# Altium project foxbms2-master.PrjPcb (part 3 of 8)

## Sheet ethernet-phy.SchDoc
size A3; DocumentNumber: 7; SheetNumber: 7; SheetTotal: 45; SheetDescription: Ethernet PHY
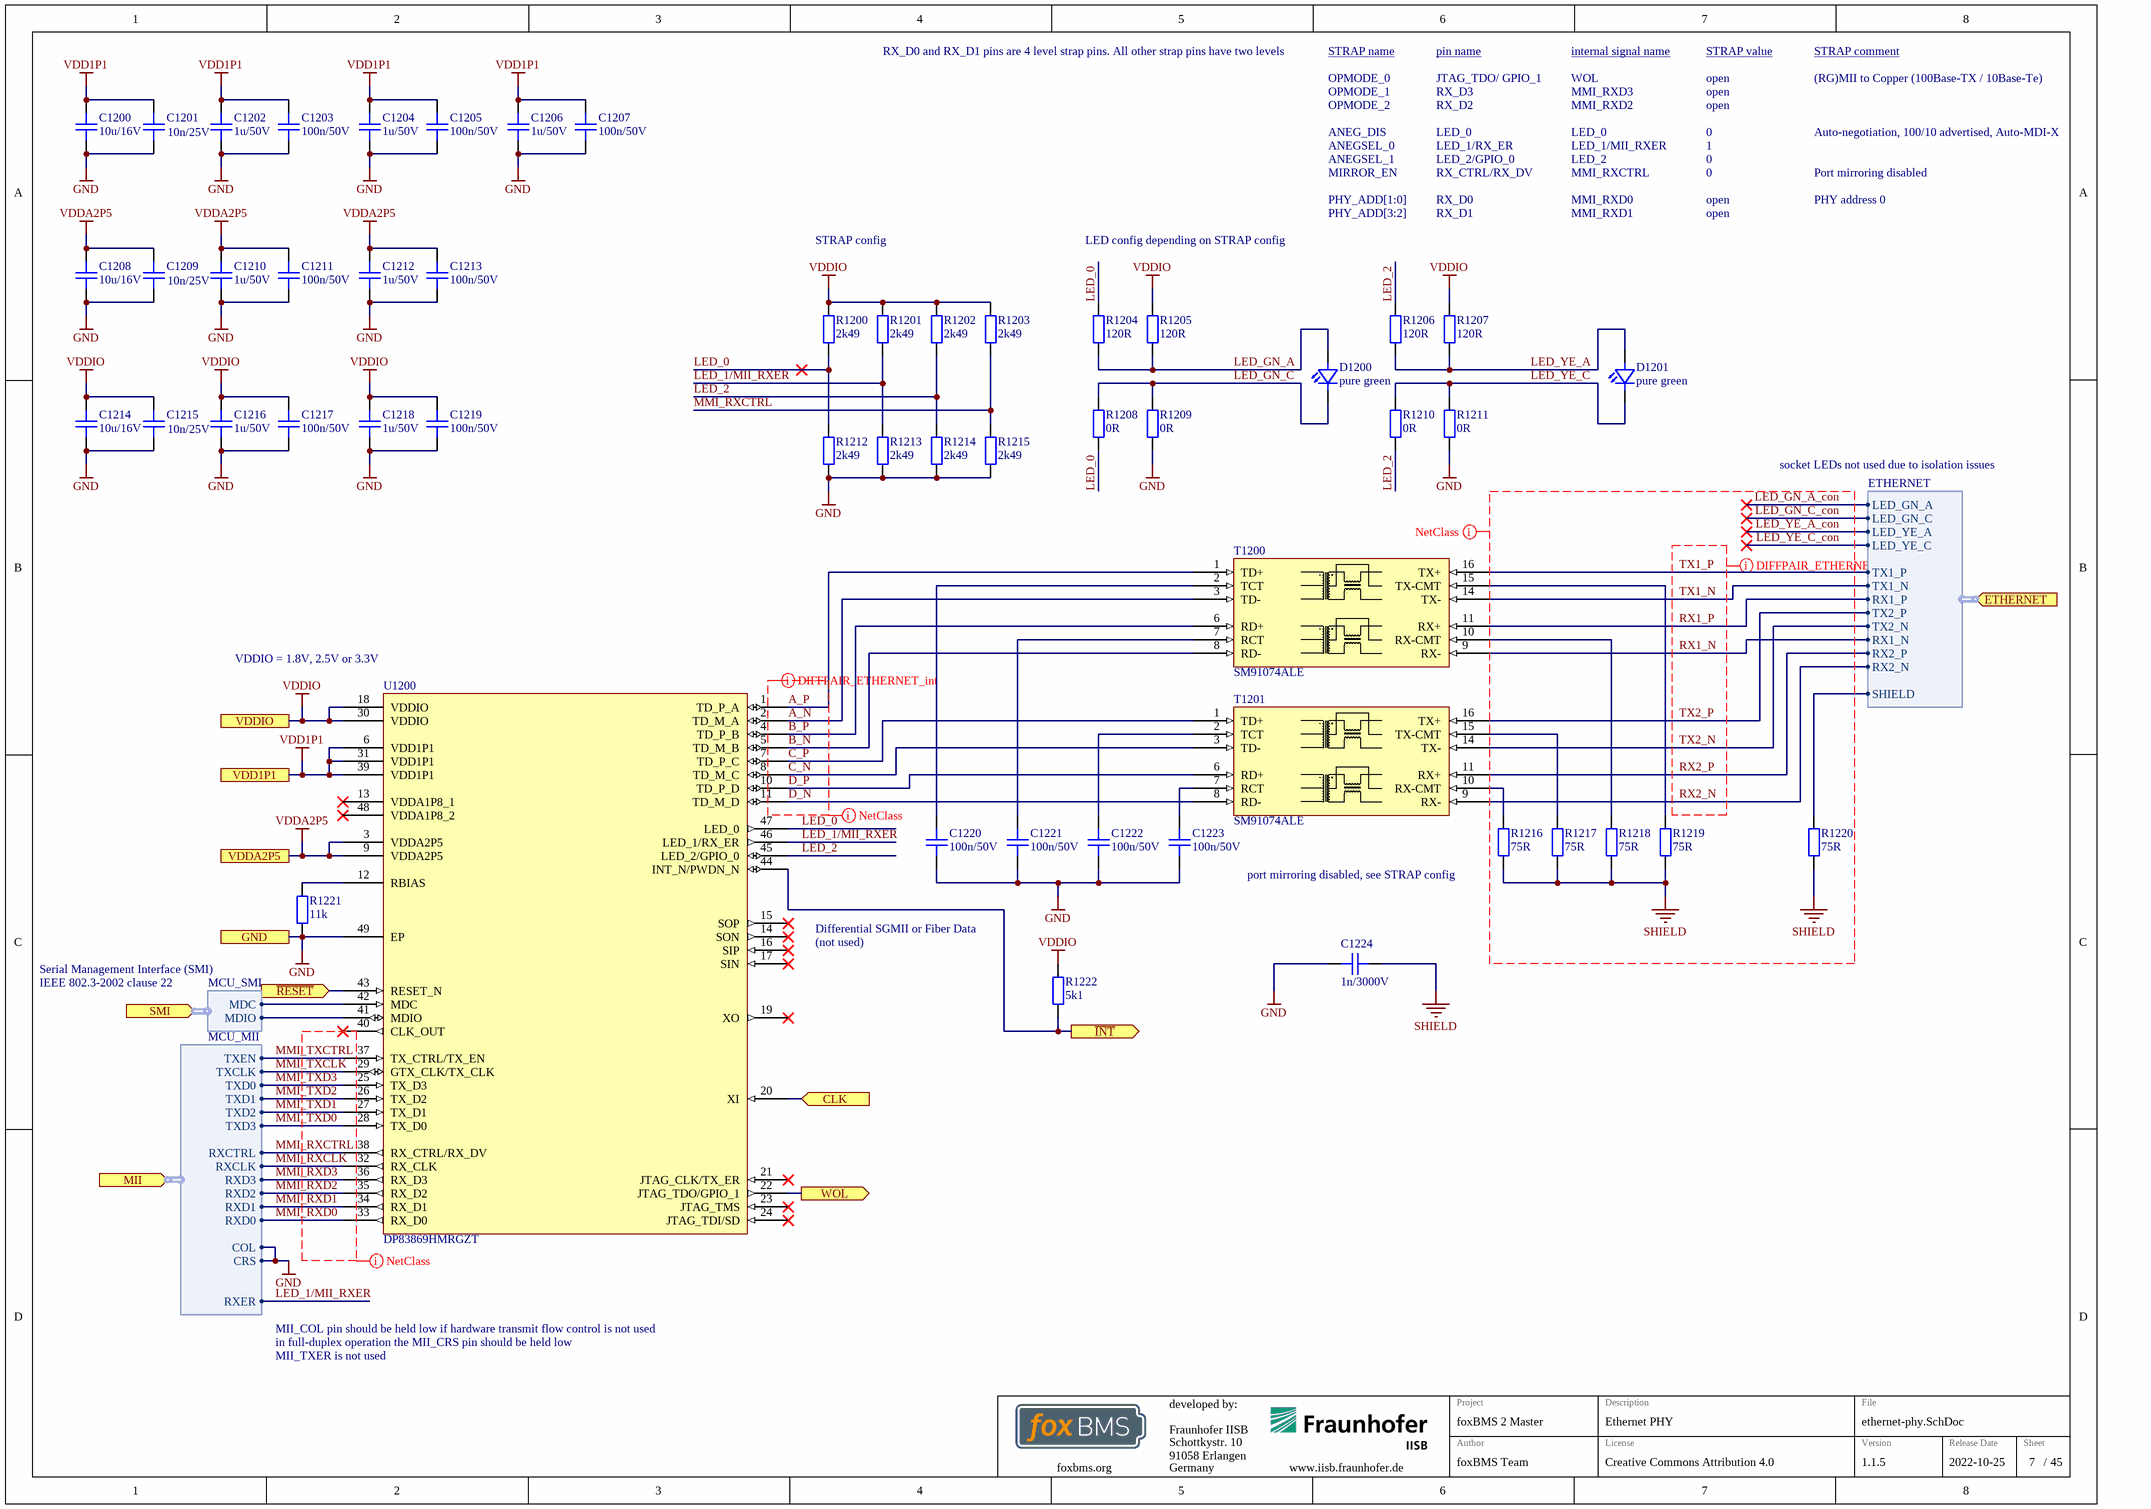
[diagram p14: ethernet-phy.SchDoc]

### Parts
C1200  10u/16V  [CAPC2012X14N]
C1201  10n/25V  [CAPC1005X06N]
C1202  1u/50V  [CAPC1608X08N]
C1203  100n/50V  [CAPC1005X06N]
C1204  1u/50V  [CAPC1608X08N]
C1205  100n/50V  [CAPC1005X06N]
C1206  1u/50V  [CAPC1608X08N]
C1207  100n/50V  [CAPC1005X06N]
C1208  10u/16V  [CAPC2012X14N]
C1209  10n/25V  [CAPC1005X06N]
C1210  1u/50V  [CAPC1608X08N]
C1211  100n/50V  [CAPC1005X06N]
C1212  1u/50V  [CAPC1608X08N]
C1213  100n/50V  [CAPC1005X06N]
C1214  10u/16V  [CAPC2012X14N]
C1215  10n/25V  [CAPC1005X06N]
C1216  1u/50V  [CAPC1608X08N]
C1217  100n/50V  [CAPC1005X06N]
C1218  1u/50V  [CAPC1608X08N]
C1219  100n/50V  [CAPC1005X06N]
C1220  100n/50V  [CAPC1005X06N]
C1221  100n/50V  [CAPC1005X06N]
C1222  100n/50V  [CAPC1005X06N]
C1223  100n/50V  [CAPC1005X06N]
C1224  1n/3000V  [CAPC2220(5750)230_N]
D1200  pure green  [LEDC1608X07N]
D1201  pure green  [LEDC1608X07N]
R1200  2k49  [RESC1005X04N]
R1201  2k49  [RESC1005X04N]
R1202  2k49  [RESC1005X04N]
R1203  2k49  [RESC1005X04N]
R1204  120R  [RESC1005X04N]
R1205  120R  [RESC1005X04N]
R1206  120R  [RESC1005X04N]
R1207  120R  [RESC1005X04N]
R1208  0R  [RESC1005X04N]
R1209  0R  [RESC1005X04N]
R1210  0R  [RESC1005X04N]
R1211  0R  [RESC1005X04N]
R1212  2k49  [RESC1005X04N]
R1213  2k49  [RESC1005X04N]
R1214  2k49  [RESC1005X04N]
R1215  2k49  [RESC1005X04N]
R1216  75R  [RESC1005X04N]
R1217  75R  [RESC1005X04N]
R1218  75R  [RESC1005X04N]
R1219  75R  [RESC1005X04N]
R1220  75R  [RESC1005X04N]
R1221  11k  [RESC1005X04N]
R1222  5k1  [RESC1005X04N]
T1200  SM91074ALE  [SM91074ALE]
T1201  SM91074ALE  [SM91074ALE]
U1200  DP83869HMRGZT  [DP83869HM-RGZ]

### Ports
CLK (in), ETHERNET (in, harness ETHERNET), GND, MII (in, harness MCU_MII), SMI (in, harness MCU_SMI), VDD1P1, VDDA2P5, VDDIO, WOL (out), ~{INT} (out), ~{RESET} (in)

### Harnesses
MCU_MII: TXD0, TXD1, TXD2, TXD3, TXEN, TXCLK, RXCTRL, RXCLK, RXD3, RXD2, RXD0, RXD1, RXER, COL, CRS
MCU_SMI: MDC, MDIO
ETHERNET: TX1_P, TX1_N, RX1_P, TX2_P, TX2_N, RX1_N, RX2_P, RX2_N, SHIELD, LED_YE_C, LED_YE_A, LED_GN_C, LED_GN_A

### Nets
GND: C1200.1 C1201.1 C1202.1 C1203.1 C1204.1 C1205.1 C1206.1 C1207.1 C1208.1 C1209.1 C1210.1 C1211.1 C1212.1 C1213.1 C1214.1 C1215.1 C1216.1 C1217.1 C1218.1 C1219.1 C1220.1 C1221.1 C1222.1 C1223.1 C1224.1 R1209.1 R1211.1 R1212.1 R1213.1 R1214.1 R1215.1 R1221.1 U1200.49(EP) ; port GND, port MII.COL, port MII.CRS
SHIELD: C1224.2 R1216.1 R1217.1 R1218.1 R1219.1 R1220.1
VDD1P1: C1200.2 C1201.2 C1202.2 C1203.2 C1204.2 C1205.2 C1206.2 C1207.2 U1200.6(VDD1P1) U1200.31(VDD1P1) U1200.39(VDD1P1) ; port VDD1P1  [project net MCU_1.1V]
VDDA2P5: C1208.2 C1209.2 C1210.2 C1211.2 C1212.2 C1213.2 U1200.3(VDDA2P5) U1200.9(VDDA2P5) ; port VDDA2P5  [project net MCU_2.5V]
VDDIO: C1214.2 C1215.2 C1216.2 C1217.2 C1218.2 C1219.2 R1200.2 R1201.2 R1202.2 R1203.2 R1205.2 R1207.2 R1222.2 U1200.18(VDDIO) U1200.30(VDDIO) ; port VDDIO  [project net MCU_3.3V]
A_N: T1200.3(TD-) U1200.2(TD_M_A)  [project net A_N_7]
A_P: T1200.1(TD+) U1200.1(TD_P_A)  [project net A_P_7]
B_N: T1200.8(RD-) U1200.5(TD_M_B)  [project net B_N_7]
B_P: T1200.6(RD+) U1200.4(TD_P_B)  [project net B_P_7]
C_N: T1201.3(TD-) U1200.8(TD_M_C)  [project net C_N_7]
C_P: T1201.1(TD+) U1200.7(TD_P_C)  [project net C_P_7]
COM_IO~{.}ETH_INT: R1222.1 U1200.44(INT_N/PWDN_N) ; port ~{INT}
COM_IO_PE.IO1_2: U1200.43(RESET_N) ; port ~{RESET}
D_N: T1201.8(RD-) U1200.11(TD_M_D)  [project net D_N_7]
D_P: T1201.6(RD+) U1200.10(TD_P_D)  [project net D_P_7]
ETHERNET.SHIELD: R1220.2 ; port ETHERNET.SHIELD
LED_0: R1200.1 R1204.2 R1208.1 R1212.2 U1200.47(LED_0)  [project net LED_0_7]
LED_1/MII_RXER: R1201.1 R1213.2 U1200.46(LED_1/RX_ER) ; port MII.RXER  [project net MCU_MII.RXER]
LED_2: R1202.1 R1206.2 R1210.1 R1214.2 U1200.45(LED_2/GPIO_0)  [project net LED_2_7]
LED_GN_A: D1200.2(A) R1204.1 R1205.1  [project net LED_GN_A_7]
LED_GN_C: D1200.1(C) R1208.2 R1209.2  [project net LED_GN_C_7]
LED_YE_A: D1201.2(A) R1206.1 R1207.1  [project net LED_YE_A_7]
LED_YE_C: D1201.1(C) R1210.2 R1211.2  [project net LED_YE_C_7]
MCU_CLK.25MHz: U1200.20(XI) ; port CLK
MCU_SMI.MDC: U1200.42(MDC) ; port SMI.MDC
MCU_SMI.MDIO: U1200.41(MDIO) ; port SMI.MDIO
MMI_RXCLK: U1200.32(RX_CLK) ; port MII.RXCLK  [project net MCU_MII.RXCLK]
MMI_RXCTRL: R1203.1 R1215.2 U1200.38(RX_CTRL/RX_DV) ; port MII.RXCTRL  [project net MCU_MII.RXCTRL]
MMI_RXD0: U1200.33(RX_D0) ; port MII.RXD0  [project net MCU_MII.RXD0]
MMI_RXD1: U1200.34(RX_D1) ; port MII.RXD1  [project net MCU_MII.RXD1]
MMI_RXD2: U1200.35(RX_D2) ; port MII.RXD2  [project net MCU_MII.RXD2]
MMI_RXD3: U1200.36(RX_D3) ; port MII.RXD3  [project net MCU_MII.RXD3]
MMI_TXCLK: U1200.29(GTX_CLK/TX_CLK) ; port MII.TXCLK  [project net MCU_MII.TXCLK]
MMI_TXCTRL: U1200.37(TX_CTRL/TX_EN) ; port MII.TXEN  [project net MCU_MII.TXEN]
MMI_TXD0: U1200.28(TX_D0) ; port MII.TXD3  [project net MCU_MII.TXD3]
MMI_TXD1: U1200.27(TX_D1) ; port MII.TXD2  [project net MCU_MII.TXD2]
MMI_TXD2: U1200.26(TX_D2) ; port MII.TXD1  [project net MCU_MII.TXD1]
MMI_TXD3: U1200.25(TX_D3) ; port MII.TXD0  [project net MCU_MII.TXD0]
RX1_N: T1200.9(RX-) ; port ETHERNET.RX1_N  [project net ETHERNET.RX1_N]
RX1_P: T1200.11(RX+) ; port ETHERNET.RX1_P  [project net ETHERNET.RX1_P]
RX2_N: T1201.9(RX-) ; port ETHERNET.RX2_N  [project net ETHERNET.RX2_N]
RX2_P: T1201.11(RX+) ; port ETHERNET.RX2_P  [project net ETHERNET.RX2_P]
TX1_N: T1200.14(TX-) ; port ETHERNET.TX1_N  [project net ETHERNET.TX1_N]
TX1_P: T1200.16(TX+) ; port ETHERNET.TX1_P  [project net ETHERNET.TX1_P]
TX2_N: T1201.14(TX-) ; port ETHERNET.TX2_N  [project net ETHERNET.TX2_N]
TX2_P: T1201.16(TX+) ; port ETHERNET.TX2_P  [project net ETHERNET.TX2_P]
NetC1220_2: C1220.2 T1200.2(TCT)
NetC1221_2: C1221.2 T1200.7(RCT)
NetC1222_2: C1222.2 T1201.2(TCT)
NetC1223_2: C1223.2 T1201.7(RCT)
NetR1216_2: R1216.2 T1201.10(RX-CMT)
NetR1217_2: R1217.2 T1201.15(TX-CMT)
NetR1218_2: R1218.2 T1200.10(RX-CMT)
NetR1219_2: R1219.2 T1200.15(TX-CMT)
NetR1221_2: R1221.2 U1200.12(RBIAS)
NetU1200_22: U1200.22(JTAG_TDO/GPIO_1) ; port WOL

Not connected (* = marked no-connect by the designer): U1200 13(VDDA1P8_1)* 14(SON)* 15(SOP)* 16(SIP)* 17(SIN)* 19(XO)* 21(JTAG_CLK/TX_ER)* 23(JTAG_TMS)* 24(JTAG_TDI/SD)* 40(CLK_OUT)* 48(VDDA1P8_2)*

### Layout directives
differential pair; rule Differential Pairs Routing [Pref Gap = 12.5mil    Min Gap  = 6mil    Max Gap  = 12.5milPref Width = 6mil    Min Width  = 4mil    Max Width  = 10mil]: A_N, A_P, B_N, B_P, C_N, C_P, D_N, D_P, RX1_N, RX1_P, RX2_N, RX2_P, TX1_N, TX1_P, TX2_N, TX2_P
net class ETHERNET_EXT: LED_GN_A_con, LED_GN_C_con, LED_YE_A_con, LED_YE_C_con, RX1_N, RX1_P, RX2_N, RX2_P, SHIELD, TX1_N, TX1_P, TX2_N, TX2_P
net class MCU_MII: (no net found under the mark)
net class ETHERNET_INT: A_N, A_P, B_N, B_P, C_N, C_P, D_N, D_P

### Notes on the sheet
- RX_D0 and RX_D1 pins are 4 level strap pins. All other strap pins have two levels
- STRAP name
- OPMODE_0
- OPMODE_1
- OPMODE_2
- pin name
- JTAG_TDO/ GPIO_1
- RX_D3
- RX_D2
- internal signal name
- WOL
- MMI_RXD3
- MMI_RXD2
- STRAP value
- open
- STRAP comment
- (RG)MII to Copper (100Base-TX / 10Base-Te)
- ANEG_DIS
- ANEGSEL_0
- ANEGSEL_1
- MIRROR_EN
- LED_0
- LED_1/RX_ER
- LED_2/GPIO_0
- RX_CTRL/RX_DV
- LED_1/MII_RXER
- LED_2
- MMI_RXCTRL
- 0
- 1
- Auto-negotiation, 100/10 advertised, Auto-MDI-X
- Port mirroring disabled
- STRAP config
- LED config depending on STRAP config
- PHY_ADD[1:0]
- PHY_ADD[3:2]
- RX_D0
- RX_D1
- MMI_RXD0
- MMI_RXD1
- PHY address 0
- socket LEDs not used due to isolation issues
- (near U1200) VDDIO = 1.8V, 2.5V or 3.3V
- (near R1216) port mirroring disabled, see STRAP config
- Serial Management Interface (SMI)
- IEEE 802.3-2002 clause 22
- Differential SGMII or Fiber Data
- (not used)
- MII_COL pin should be held low if hardware transmit flow control is not used
- in full-duplex operation the MII_CRS pin should be held low
- MII_TXER is not used
- Fraunhofer IISB
- Schottkystr. 10
- developed by:
- 91058 Erlangen
- Germany
- Author
- Project
- License
- Description
- File
- Version
- Release Date
- Sheet
- foxbms.org <https://foxbms.org>
- www.iisb.fraunhofer.de <https://www.iisb.fraunhofer.de/>
- foxBMS Team
- /

### Library data of the parts
C1200 C1208 C1214 = gen_C_ceramic_10u_16V_X7R_0805: MLCC; Capacitance: 10u; Rated Voltage: 16V; Dielectric: X7S; Case EIA: 0805; Case Metric: 2012; Automotive Qualified: True; AEC-Q Grade: Grade 1; AEC-Q Norm: AEC-Q200; Part Number: gen_C_ceramic_10u_16V_X7R_0805; ECCN: EAR99; Supplier 1: Digikey; Supplier Part Number 1: 445-16110-1-ND
C1201 C1209 C1215 = gen_C_ceramic_10n_25V_X7R_0402: MLCC; Capacitance: 10n; Rated Voltage: 25V; Dielectric: X7R; Case EIA: 0402; Case Metric: 1005; PnP Package: 0402C; PnP Value: 10nF/25V/X7R; PnP equipped: x; Automotive Qualified: True; Part Number: gen_C_ceramic_10n_25V_X7R_0402; Supplier 1: Farnell; Supplier Part Number 1: 2210793
C1202 C1204 C1206 C1210 C1212 C1216 C1218 = gen_C_ceramic_1u_50V_X7R_0603: MLCC; Capacitance: 1u; Rated Voltage: 50V; Dielectric: X7R; Tolerance: ± 10%; Case EIA: 0603; Case Metric: 1608; Automotive Qualified: False; PnP Package: 0603C; Part Number: gen_C_ceramic_1u_50V_X7R_0603; Operating Temperature: -55°C - +125°C; Supplier 1: Farnell; Supplier Part Number 1: 2779055
C1203 C1205 C1207 C1211 C1213 C1217 C1219-C1223 = gen_C_ceramic_100n_50V_X7R_0402: as C3000 on sheet connectors-internal; Part Number: gen_C_ceramic_100n_50V_X7R_0402; Supplier 1: Farnell; Supplier Part Number 1: 2210822; ECCN: EAR99
C1224 = gen_C_ceramic_1n_3000V_X7R_2220: MLCC; Capacitance: 1n; Rated Voltage: 3000V; Dielectric: X7R; Case EIA: 2220; Case Metric: 5750; Automotive Qualified: True; AEC-Q Norm: AEC-Q200; AEC-Q Grade: Grade 0; Part Number: gen_C_ceramic_1n_3000V_X7R_2220; Supplier 1: Digikey; Supplier Part Number 1: 399-16803-1-ND; ECCN: EAR99
D1200 D1201 = LED_0603_pure_green_AECQ: TLMP1100-GS08; Manufacturer: Vishay; Breakdown Voltage: 5V; Continuous Forward Current: 20mA; Forward Voltage @ 20mA: 2.1V; Automotive Qualified: True; Part Number: LED_0603_pure_green_AECQ; Color: pure green; Operating Temperature: -40°C - 100°C; ComponentLink1Description: Datasheet; ComponentLink1URL: http://www.farnell.com/datasheets/2049164.pdf; Supplier 1: Farnell; Supplier Part Number 1: 1328306; Supplier 2: Digikey; Supplier Part Number 2: 751-1176-1-ND; PnP Package: LED_0603
R1200-R1203 R1212-R1215 = gen_R_2k49_0402: SMD Resistor 2k49 0402; Tolerance: 1%; Power: 0.063W; Case EIA: 0402; Case Metric: 1005; Maximum Working Voltage: 50V; PnP Package: 0402R; Automotive Qualified: True; Part Number: gen_R_2k49_0402; Operating Temperature: -55°C - +155°C; Resistance: 2k49; Series: E96; PnP Value: 2k49; Supplier 1: Farnell; Supplier Part Number 1: 2059135
R1204-R1207 = gen_R_120R_0402: SMD Resistor 120R 0402; Tolerance: 1%; Power: 0.063W; Case EIA: 0402; Case Metric: 1005; Maximum Working Voltage: 50V; PnP Package: 0402R; Automotive Qualified: True; AEC-Q Norm: AEC-Q200; Part Number: gen_R_120R_0402; Operating Temperature: -55°C - +155°C; Resistance: 120R; Series: E24; PnP Value: 120R; Supplier 1: Farnell; Supplier Part Number 1: 2302535; ECCN: EAR99
R1208-R1211 = gen_R_0R_0402: as R1101 on sheet can; Part Number: gen_R_0R_0402; Operating Temperature: -55°C - +155°C; Resistance: 0R; Series: Jumper; PnP Value: 0R; Supplier 1: Farnell; Supplier Part Number 1: 1469661; Supplier 2: Farnell; Supplier Part Number 2: 2059190; ECCN: EAR99
R1216-R1220 = gen_R_75R_0402: SMD Resistor 75R 0402; Tolerance: 1%; Power: 0.063W; Case EIA: 0402; Case Metric: 1005; Maximum Working Voltage: 50V; PnP Package: 0402R; Automotive Qualified: True; AEC-Q Norm: AEC-Q200; AEC-Q Grade: Grade 0; Part Number: gen_R_75R_0402; Operating Temperature: -55°C - +155°C; Resistance: 75R; Series: E24, E96; PnP Value: 75R; ECCN: EAR99; Supplier 1: Farnell; Supplier Part Number 1: 2059111
R1221 = gen_R_11k_0402: SMD Resistor 11k 0402; Tolerance: 1%; Power: 0.063W; Case EIA: 0402; Case Metric: 1005; Maximum Working Voltage: 50V; PnP Package: 0402R; Automotive Qualified: True; AEC-Q Norm: AEC-Q200; Part Number: gen_R_11k_0402; Operating Temperature: -55°C - +155°C; Resistance: 11k; Series: E24, E96; PnP Value: 11k; ECCN: EAR99; Supplier 1: Farnell; Supplier Part Number 1: 2324762
R1222 = gen_R_5k1_0402: SMD Resistor 5k1 0402; Tolerance: 1%; Power: 0.063W; Case EIA: 0402; Case Metric: 1005; Maximum Working Voltage: 50V; PnP Package: 0402R; Automotive Qualified: True; PnP equipped: x; AEC-Q Norm: AEC-Q200; AEC-Q Grade: Grade 0; Part Number: gen_R_5k1_0402; Operating Temperature: -55°C - +155°C; Resistance: 5k1; Series: E24; PnP Value: 5k1; Supplier 1: Farnell; Supplier Part Number 1: 2302709; ECCN: EAR99
T1200 T1201 = SM91074ALE: 10/100 Base-T Transformer; Manufacturer: Bourns; Automotive Qualified: True; Part Number: SM91074ALE; Part Name: SM91074ALE; Operating Temperature: −40°C - +125°C; ComponentLink1Description: Datasheet; ComponentLink1URL: https://datasheet.octopart.com/SM91074ALE-Bourns-datasheet-134093235.pdf; Supplier 1: Farnell; Supplier Part Number 1: 2932105; Supplier 2: Mouser; Supplier Part Number 2: 652-SM91074ALE; Supplier 3: Digikey; Supplier Part Number 3: SM91074ALECT-ND
U1200 = DP83869HMRGZT: High Immunity 10/100/1000 Ethernet Physical Layer Transceiver and Fiber Interface; Manufacturer: Texas Instruments; PnP Package: VQFN-48; Automotive Qualified: False; Part Number: DP83869HMRGZT; Part Name: DP83869HMRGZT; Operating Temperature: −40°C - +125°C; ComponentLink1Description: Datasheet; ComponentLink1URL: http://www.ti.com/lit/ds/symlink/dp83869hm.pdf; Supplier 1: Digikey; Supplier Part Number 1: 296-53377-1-ND; Supplier 2: Mouser; Supplier Part Number 2: 595-DP83869HMRGZT

## Sheet uart.SchDoc
size A3; DocumentNumber: 8; SheetNumber: 8; SheetTotal: 45; SheetDescription: UART Communication
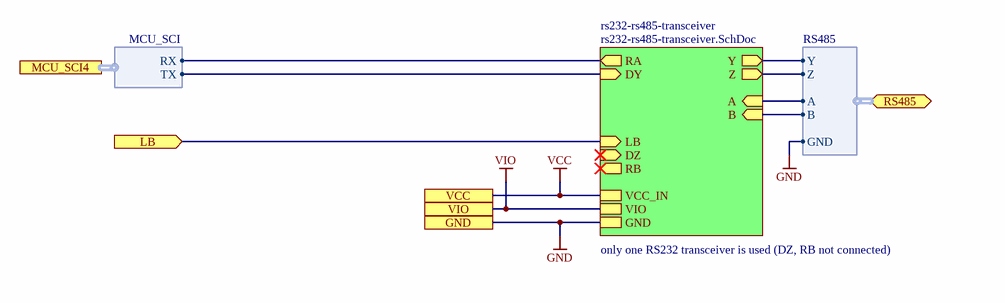
[diagram p15: uart.SchDoc]

### Sub-sheets
rs232-rs485-transceiver = rs232-rs485-transceiver.SchDoc: GND, Z (out), Y (out), B (in), RA (out), DZ (in), A (in), RB (out), DY (in), LB (in), VCC_IN, VIO

### Ports
GND, LB (in), MCU_SCI4 (harness MCU_SCI), RS485 (bidir, harness RS485), VCC, VIO

### Harnesses
RS485: Y, Z, A, B, GND
MCU_SCI: RX, TX

### Nets
GND: port GND, sheet rs232-rs485-transceiver/GND, port RS485.GND
VCC: port VCC, sheet rs232-rs485-transceiver/VCC_IN  [project net PER_5.0V]
VIO: port VIO, sheet rs232-rs485-transceiver/VIO  [project net PER_3.3V]
COM_IO_PE.IO1_4: port LB, sheet rs232-rs485-transceiver/LB
MCU_SCI4.RX: sheet rs232-rs485-transceiver/RA, port MCU_SCI4.RX
MCU_SCI4.TX: sheet rs232-rs485-transceiver/DY, port MCU_SCI4.TX
RS485.A: sheet rs232-rs485-transceiver/A, port RS485.A
RS485.B: sheet rs232-rs485-transceiver/B, port RS485.B
RS485.Y: sheet rs232-rs485-transceiver/Y, port RS485.Y
RS485.Z: sheet rs232-rs485-transceiver/Z, port RS485.Z

### Notes on the sheet
- only one RS232 transceiver is used (DZ, RB not connected)
- Fraunhofer IISB
- Schottkystr. 10
- developed by:
- 91058 Erlangen
- Germany
- Author
- Project
- License
- Description
- File
- Version
- Release Date
- Sheet
- foxbms.org <https://foxbms.org>
- www.iisb.fraunhofer.de <https://www.iisb.fraunhofer.de/>
- foxBMS Team
- /

## Sheet rs232-rs485-transceiver.SchDoc
size A3; DocumentNumber: 9; SheetNumber: 9; SheetTotal: 45; SheetDescription: RS422/RS485 Transceiver
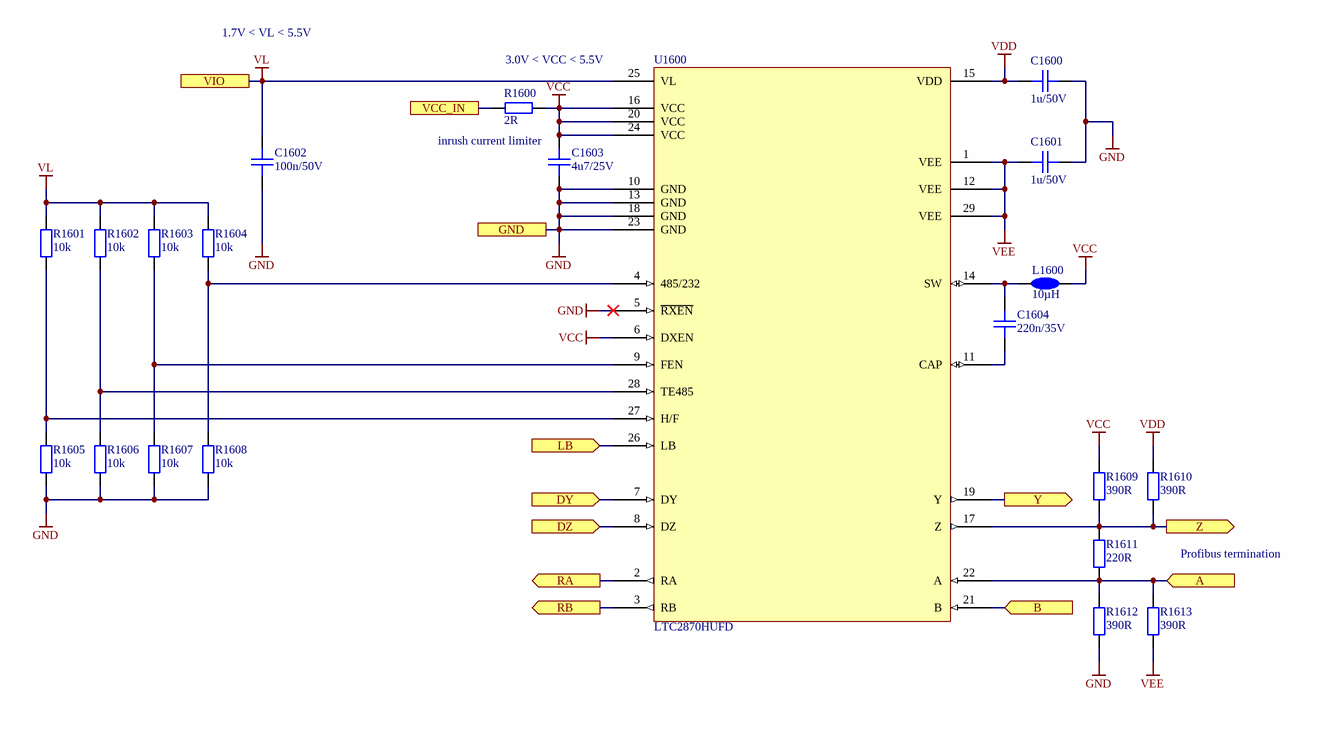
[diagram p16: rs232-rs485-transceiver.SchDoc]

### Parts
C1600  1u/50V  [CAPC1608X08N]
C1601  1u/50V  [CAPC1608X08N]
C1602  100n/50V  [CAPC1005X06N]
C1603  4u7/25V  [CAPC2012X14N]
C1604  220n/35V  [CAPC1005X06N]
L1600  10µH  [INDC2012X14N]
R1600  2R  [RESC2012X05N]
R1601  10k  [RESC1005X04N]
R1602  10k  [RESC1005X04N]
R1603  10k  [RESC1005X04N]
R1604  10k  [RESC1005X04N]
R1605  10k  [RESC1005X04N]
R1606  10k  [RESC1005X04N]
R1607  10k  [RESC1005X04N]
R1608  10k  [RESC1005X04N]
R1609  390R  [RESC1005X04N]
R1610  390R  [RESC1005X04N]
R1611  220R  [RESC1005X04N]
R1612  390R  [RESC1005X04N]
R1613  390R  [RESC1005X04N]
U1600  LTC2870HUFD  [LTC2870-UFD]

### Ports
A (in), B (in), DY (in), DZ (in), GND, LB (in), RA (out), RB (out), VCC_IN, VIO, Y (out), Z (out)

### Nets
GND: C1600.2 C1601.2 C1602.1 C1603.1 R1605.1 R1606.1 R1607.1 R1608.1 R1612.1 U1600.5(~{RXEN}) U1600.10(GND) U1600.13(GND) U1600.18(GND) U1600.23(GND) ; port GND
PER_5.0V: R1600.1 ; port VCC_IN
VCC: C1603.2 L1600.2 R1600.2 R1609.2 U1600.6(DXEN) U1600.16(VCC) U1600.20(VCC) U1600.24(VCC)
VDD: C1600.1 R1610.2 U1600.15(VDD)
VEE: C1601.1 R1613.1 U1600.1(VEE) U1600.12(VEE) U1600.29(VEE)
VL: C1602.2 R1601.2 R1602.2 R1603.2 R1604.2 U1600.25(VL) ; port VIO  [project net PER_3.3V]
COM_IO_PE.IO1_4: U1600.26(LB) ; port LB
MCU_SCI4.RX: U1600.2(RA) ; port RA
MCU_SCI4.TX: U1600.7(DY) ; port DY
RS485.A: R1611.1 R1612.2 R1613.2 U1600.22(A) ; port A
RS485.B: U1600.21(B) ; port B
RS485.Y: U1600.19(Y) ; port Y
RS485.Z: R1609.1 R1610.1 R1611.2 U1600.17(Z) ; port Z
NetC1604_1: C1604.1 U1600.11(CAP)
NetC1604_2: C1604.2 L1600.1 U1600.14(SW)
NetR1601_1: R1601.1 R1605.2 U1600.27(H/F)
NetR1602_1: R1602.1 R1606.2 U1600.28(TE485)
NetR1603_1: R1603.1 R1607.2 U1600.9(FEN)
NetR1604_1: R1604.1 R1608.2 U1600.4(485/232)
NetU1600_3: U1600.3(RB) ; port RB
NetU1600_8: U1600.8(DZ) ; port DZ

### Notes on the sheet
- 1.7V < VL < 5.5V
- 3.0V < VCC < 5.5V
- (near C1603) inrush current limiter
- Profibus termination
- Fraunhofer IISB
- Schottkystr. 10
- developed by:
- 91058 Erlangen
- Germany
- Author
- Project
- License
- Description
- File
- Version
- Release Date
- Sheet
- foxbms.org <https://foxbms.org>
- www.iisb.fraunhofer.de <https://www.iisb.fraunhofer.de/>
- foxBMS Team
- /

### Library data of the parts
C1600 C1601 = gen_C_ceramic_1u_50V_X7R_0603: as C1202 on sheet ethernet-phy; Part Number: gen_C_ceramic_1u_50V_X7R_0603; Operating Temperature: -55°C - +125°C; Supplier 1: Farnell; Supplier Part Number 1: 2779055
C1602 = gen_C_ceramic_100n_50V_X7R_0402: as C3000 on sheet connectors-internal; Part Number: gen_C_ceramic_100n_50V_X7R_0402; Supplier 1: Farnell; Supplier Part Number 1: 2210822; ECCN: EAR99
C1603 = gen_C_ceramic_4u7_25V_X7R_0805: MLCC; Capacitance: 4u7; Rated Voltage: 25V; Dielectric: X7R; Case EIA: 0805; Case Metric: 2012; AVT Set: x; Automotive Qualified: True; AEC-Q Norm: AEC-Q200; Part Number: gen_C_ceramic_4u7_25V_X7R_0805; Supplier 1: Farnell; Supplier Part Number 1: 2346968; ECCN: EAR99
C1604 = gen_C_ceramic_220n_35V_X7R_0402: MLCC; Capacitance: 220n; Rated Voltage: 35V; Dielectric: X7R; Case EIA: 0402; Case Metric: 1005; Automotive Qualified: True; AEC-Q Grade: Grade 1; AEC-Q Norm: AEC-Q200; PnP Package: 0402C; Part Number: gen_C_ceramic_220n_35V_X7R_0402; ECCN: EAR99; Supplier 1: Digikey; Supplier Part Number 1: 445-173767-1-ND
L1600 = LQM21DH100M70L: Power Inductor; Manufacturer: Murata; Rated Current: 300mA; Saturation Current: 250mA; Automotive Qualified: True; Part Number: LQM21DH100M70L; Operating Temperature: -55°C - +150°C; ComponentLink1Description: Datasheet; ComponentLink1URL: https://psearch.en.murata.com/inductor/product/LQM21DH100M70_.pdf; Inductance: 10µH; Supplier 1: Digikey; Supplier Part Number 1: 490-18463-1-ND; Supplier 2: Mouser; Supplier Part Number 2: 81-LQM21DH100M70L
R1600 = gen_R_2R_0805: SMD Resistor 2R 0805; Tolerance: 1%; Power: 0.125W; Case EIA: 0805; Case Metric: 2012; Maximum Working Voltage: 150V; PnP Package: 0805R; Automotive Qualified: True; AEC-Q Grade: Grade 0; AEC-Q Norm: AEC-Q200; Part Number: gen_R_2R_0805; Operating Temperature: -55°C - +155°C; Resistance: 2R; Series: E24, E96; PnP Value: 2R; ECCN: EAR99; Supplier 1: Digikey; Supplier Part Number 1: P19275CT-ND
R1601-R1608 = gen_R_10k_0402: as R1103 on sheet can-transceiver; Part Number: gen_R_10k_0402; Operating Temperature: -55°C - +155°C; Resistance: 10k; Series: E24, E96; PnP Value: 10k; Supplier 1: Farnell; Supplier Part Number 1: 2059239; ECCN: EAR99
R1609 R1610 R1612 R1613 = gen_R_390R_0402: SMD Resistor 390R 0402; Tolerance: 1%; Power: 0.063W; Case EIA: 0402; Case Metric: 1005; Maximum Working Voltage: 50V; PnP Package: 0402R; Automotive Qualified: True; AEC-Q Grade: Grade 0; AEC-Q Norm: AEC-Q200; Part Number: gen_R_390R_0402; Operating Temperature: -55°C - +155°C; Resistance: 390R; Series: E24; PnP Value: 390R; ECCN: EAR99; Supplier 1: Farnell; Supplier Part Number 1: 2563565
R1611 = gen_R_220R_0402: SMD Resistor 220R 0402; Tolerance: 1%; Power: 0.063W; Case EIA: 0402; Case Metric: 1005; Maximum Working Voltage: 50V; PnP Package: 0402R; Automotive Qualified: True; AEC-Q Grade: Grade 0; AEC-Q Norm: AEC-Q200; Part Number: gen_R_220R_0402; Operating Temperature: -55°C - +155°C; Resistance: 220R; Series: E24; PnP Value: 220R; ECCN: EAR99; Supplier 1: Digikey; Supplier Part Number 1: A129619CT-ND
U1600 = LTC2870HUFD: RS-232-IC-Interface RS232/RS485 Multiprotocol Transceiver with Integrated Termination; Manufacturer: Analog Devices; PnP Package: QFN-28; Automotive Qualified: False; Part Number: LTC2870HUFD; Part Name: LTC2870HUFD; Operating Temperature: −40°C - +125°C; ComponentLink1Description: Datasheet; ComponentLink1URL: https://www.analog.com/media/en/technical-documentation/data-sheets/28701fb.pdf; Supplier 1: Mouser; Supplier Part Number 1: 584-LTC2870HUFD#PBF; Supplier 2: Digikey; Supplier Part Number 2: LTC2870HUFD#TRPBF-ND

## Sheet peripherals.SchDoc
size A3; DocumentNumber: 28; SheetNumber: 28; SheetTotal: 45; SheetDescription: MCU Peripherals
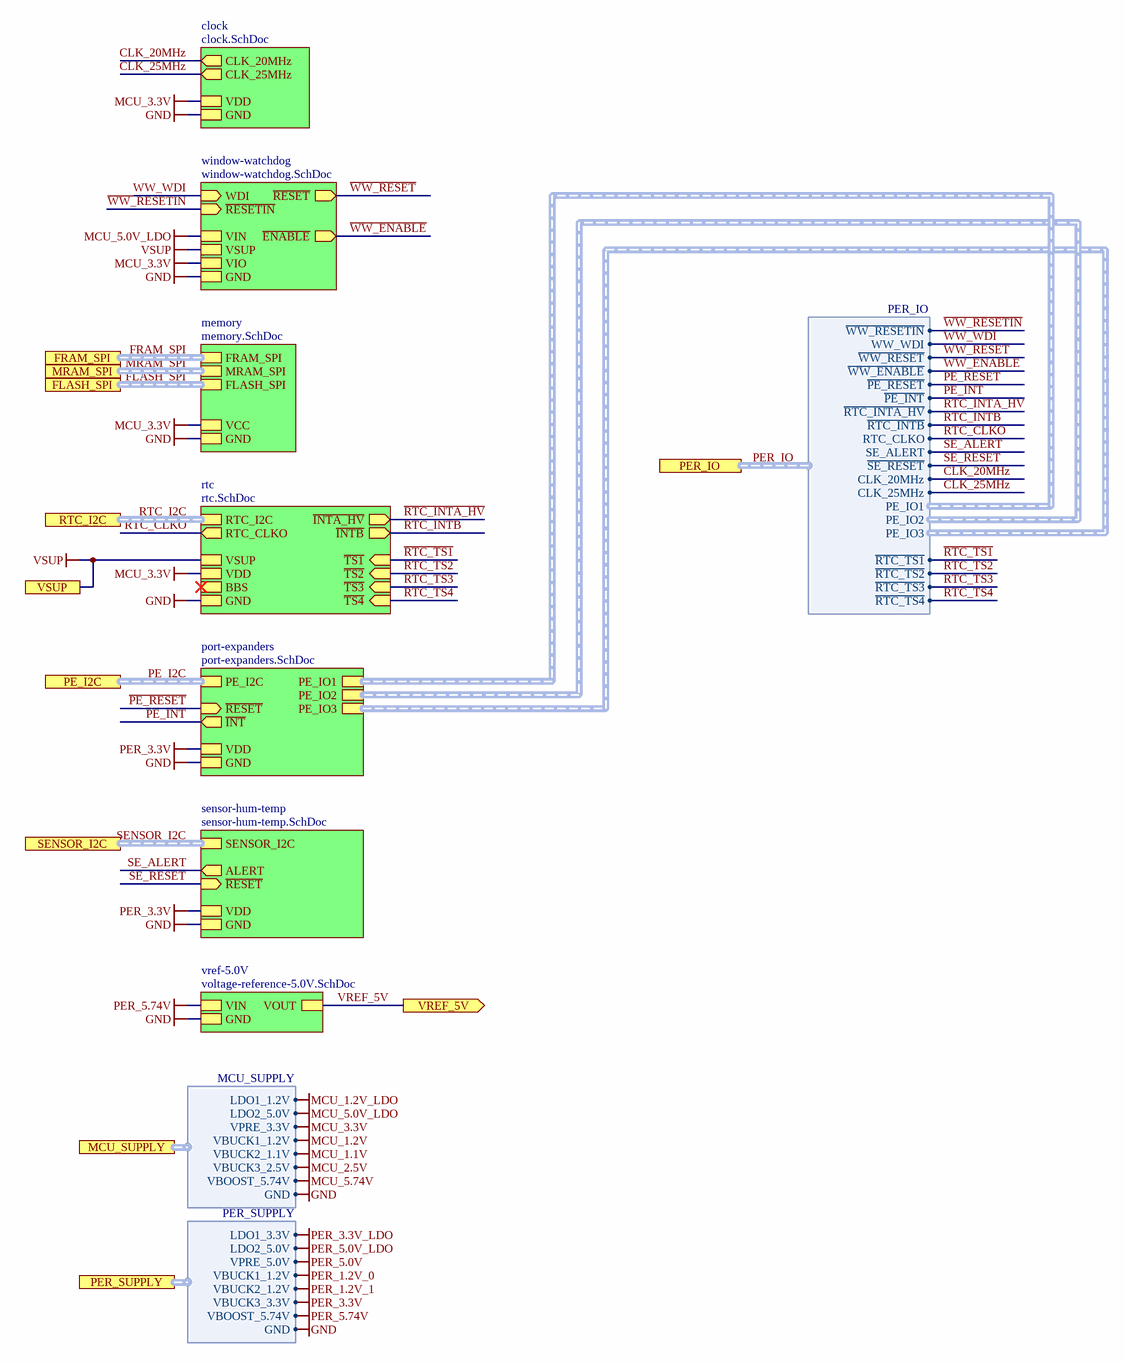
[diagram p17: peripherals.SchDoc]

### Sub-sheets
clock = clock.SchDoc: VDD, GND, CLK_20MHz (out), CLK_25MHz (out)
memory = memory.SchDoc: VCC, GND, FRAM_SPI (harness SPI), MRAM_SPI (harness SPI), FLASH_SPI (harness SPI)
port-expanders = port-expanders.SchDoc: PE_IO2 (harness PE_IO), PE_IO1 (harness PE_IO), GND, VDD, ~{RESET} (in), PE_I2C (harness I2C), ~{INT} (out), PE_IO3 (harness PE_IO)
rtc = rtc.SchDoc: RTC_I2C (harness I2C), ~{INTB} (out), ~{INTA_HV} (out), GND, VSUP, ~{TS4} (in), ~{TS3} (in), ~{TS2} (in), ~{TS1} (in), BBS, RTC_CLKO (out), VDD
sensor-hum-temp = sensor-hum-temp.SchDoc: GND, ~{RESET} (in), ALERT (out), VDD, SENSOR_I2C (harness I2C)
vref-5.0V = voltage-reference-5.0V.SchDoc: GND, VOUT, VIN
window-watchdog = window-watchdog.SchDoc: GND, VIO, ~{ENABLE} (out), ~{RESET} (out), WDI (in), VIN, ~{RESETIN} (in), VSUP

### Ports
FLASH_SPI (harness SPI), FRAM_SPI (harness SPI), MCU_SUPPLY (harness MCU_SUPPLY), MRAM_SPI (harness SPI), PE_I2C (harness I2C), PER_IO (harness PER_IO), PER_SUPPLY (harness PER_SUPPLY), RTC_I2C (harness I2C), SENSOR_I2C (harness I2C), VREF_5V (out), VSUP

### Harnesses
MCU_SUPPLY: VBUCK1_1.2V, VBUCK2_1.1V, VBUCK3_2.5V, LDO1_1.2V, LDO2_5.0V, GND, VPRE_3.3V, VBOOST_5.74V
PER_SUPPLY: GND, VBOOST_5.74V, LDO1_3.3V, LDO2_5.0V, VPRE_5.0V, VBUCK1_1.2V, VBUCK2_1.2V, VBUCK3_3.3V
PER_IO: WW_WDI, ~{WW_RESET}, ~{WW_ENABLE}, ~{PE_RESET}, ~{PE_INT}, ~{RTC_INTA_HV}, ~{RTC_INTB}, RTC_CLKO, SE_ALERT, ~{SE_RESET}, CLK_20MHz, CLK_25MHz, PE_IO1, PE_IO2, PE_IO3, ~{RTC_TS1}, ~{RTC_TS2}, ~{RTC_TS3}, ~{RTC_TS4}, ~{WW_RESETIN}

### Nets
GND: sheet clock/GND, sheet window-watchdog/GND, sheet memory/GND, sheet sensor-hum-temp/GND, sheet rtc/GND, sheet port-expanders/GND, sheet vref-5.0V/GND, port MCU_SUPPLY.GND, port PER_SUPPLY.GND
MCU_3.3V: sheet clock/VDD, sheet window-watchdog/VIO, sheet memory/VCC, sheet rtc/VDD, port MCU_SUPPLY.VPRE_3.3V
MCU_5.0V_LDO: sheet window-watchdog/VIN, port MCU_SUPPLY.LDO2_5.0V
PER_3.3V: sheet sensor-hum-temp/VDD, sheet port-expanders/VDD, port PER_SUPPLY.VBUCK3_3.3V
PER_5.74V: sheet vref-5.0V/VIN, port PER_SUPPLY.VBOOST_5.74V
VREF_5V: port VREF_5V, sheet vref-5.0V/VOUT
VSUP: port VSUP, sheet window-watchdog/VSUP, sheet rtc/VSUP  [project net VSUP_30]
~{PE_INT}: sheet port-expanders/~{INT}, port PER_IO.~{PE_INT}  [project net MCU_GIOB.4]
~{PE_RESET}: sheet port-expanders/~{RESET}, port PER_IO.~{PE_RESET}  [project net MCU_GIOX.M4]
~{RTC_INTA_HV}: sheet rtc/~{INTA_HV}, port PER_IO.~{RTC_INTA_HV}  [project net PER_IO~{.}RTC_INTA_HV]
~{RTC_INTB}: sheet rtc/~{INTB}, port PER_IO.~{RTC_INTB}  [project net MCU_GIOB.1]
~{RTC_TS1}: sheet rtc/~{TS1}, port PER_IO.~{RTC_TS1}  [project net MCU_GIOX.D13]
~{RTC_TS2}: sheet rtc/~{TS2}, port PER_IO.~{RTC_TS2}  [project net MCU_GIOX.D12]
~{RTC_TS3}: sheet rtc/~{TS3}, port PER_IO.~{RTC_TS3}  [project net MCU_GIOX.D11]
~{RTC_TS4}: sheet rtc/~{TS4}, port PER_IO.~{RTC_TS4}  [project net MCU_GIOX.K16]
~{SE_RESET}: sheet sensor-hum-temp/~{RESET}, port PER_IO.~{SE_RESET}  [project net PE_IO3.IO0_0]
~{WW_ENABLE}: sheet window-watchdog/~{ENABLE}, port PER_IO.~{WW_ENABLE}  [project net EXT_CON~{.}WW_ENABLE]
~{WW_RESET}: sheet window-watchdog/~{RESET}, port PER_IO.~{WW_RESET}  [project net ~{DBG_RESET}]
~{WW_RESETIN}: sheet window-watchdog/~{RESETIN}, port PER_IO.~{WW_RESETIN}  [project net EXT_CON~{.}SBC_MCU_RESET]
CLK_20MHz: sheet clock/CLK_20MHz, port PER_IO.CLK_20MHz  [project net EXT_CON.ADC_CLK]
CLK_25MHz: sheet clock/CLK_25MHz, port PER_IO.CLK_25MHz  [project net MCU_CLK.25MHz]
RTC_CLKO: sheet rtc/RTC_CLKO, port PER_IO.RTC_CLKO  [project net MCU_DCC.2]
SE_ALERT: sheet sensor-hum-temp/ALERT, port PER_IO.SE_ALERT  [project net PE_IO3.IO0_1]
WW_WDI: sheet window-watchdog/WDI, port PER_IO.WW_WDI  [project net MCU_GIOX.K4]

### Buses and harness runs
harness FLASH_SPI = port FLASH_SPI = sheet memory/FLASH_SPI
harness FRAM_SPI = port FRAM_SPI = sheet memory/FRAM_SPI
harness MRAM_SPI = port MRAM_SPI = sheet memory/MRAM_SPI
harness PE_I2C = port PE_I2C = sheet port-expanders/PE_I2C
harness PER_IO = port PER_IO
harness RTC_I2C = port RTC_I2C = sheet rtc/RTC_I2C
harness SENSOR_I2C = port SENSOR_I2C = sheet sensor-hum-temp/SENSOR_I2C

### Notes on the sheet
- Fraunhofer IISB
- Schottkystr. 10
- developed by:
- 91058 Erlangen
- Germany
- Author
- Project
- License
- Description
- File
- Version
- Release Date
- Sheet
- foxbms.org <https://foxbms.org>
- www.iisb.fraunhofer.de <https://www.iisb.fraunhofer.de/>
- foxBMS Team
- /

## Sheet clock.SchDoc
size A3; DocumentNumber: 29; SheetNumber: 29; SheetTotal: 45; SheetDescription: System clocks
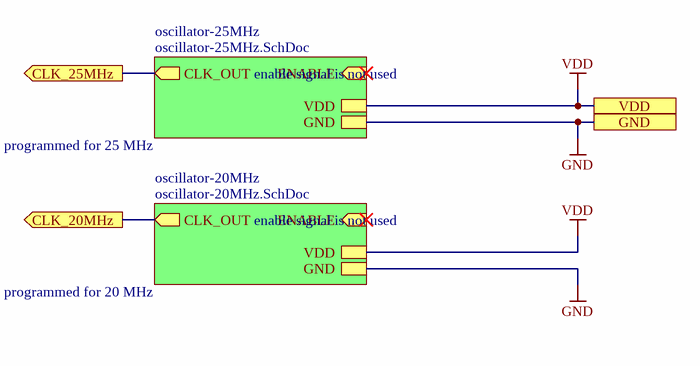
[diagram p18: clock.SchDoc]

### Sub-sheets
oscillator-20MHz = oscillator-20MHz.SchDoc: GND, ENABLE (in), CLK_OUT (out), VDD
oscillator-25MHz = oscillator-25MHz.SchDoc: GND, ENABLE (in), CLK_OUT (out), VDD

### Ports
CLK_20MHz (out), CLK_25MHz (out), GND, VDD

### Nets
GND: port GND, sheet oscillator-20MHz/GND, sheet oscillator-25MHz/GND
VDD: port VDD, sheet oscillator-20MHz/VDD, sheet oscillator-25MHz/VDD  [project net MCU_3.3V]
EXT_CON.ADC_CLK: port CLK_20MHz, sheet oscillator-20MHz/CLK_OUT
MCU_CLK.25MHz: port CLK_25MHz, sheet oscillator-25MHz/CLK_OUT

### Notes on the sheet
- enable signal is not used
- programmed for 25 MHz
- programmed for 20 MHz
- Fraunhofer IISB
- Schottkystr. 10
- developed by:
- 91058 Erlangen
- Germany
- Author
- Project
- License
- Description
- File
- Version
- Release Date
- Sheet
- foxbms.org <https://foxbms.org>
- www.iisb.fraunhofer.de <https://www.iisb.fraunhofer.de/>
- foxBMS Team
- /

## Sheet oscillator-20MHz.SchDoc
size A3; DocumentNumber: 30; SheetNumber: 30; SheetTotal: 45; SheetDescription: Oscillator
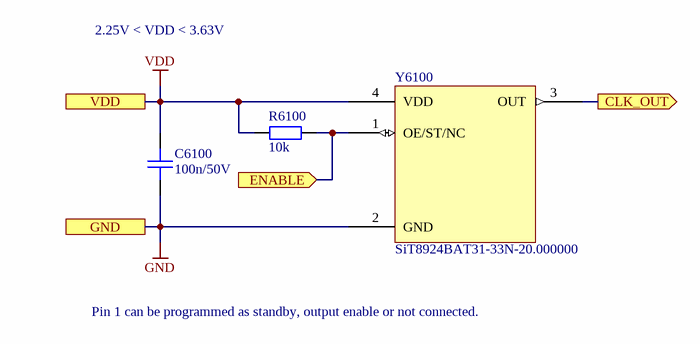
[diagram p19: oscillator-20MHz.SchDoc]

### Parts
C6100  100n/50V  [CAPC1005X06N]
R6100  10k  [RESC1005X04N]
Y6100  SiT8924BAT31-33N-20.000000  [SiT8924xx-3x]

### Ports
CLK_OUT (out), ENABLE (in), GND, VDD

### Nets
GND: C6100.1 Y6100.2(GND) ; port GND
VDD: C6100.2 R6100.1 Y6100.4(VDD) ; port VDD  [project net MCU_3.3V]
EXT_CON.ADC_CLK: Y6100.3(OUT) ; port CLK_OUT
NetR6100_2: R6100.2 Y6100.1(OE/ST/NC) ; port ENABLE

### Notes on the sheet
- 2.25V < VDD < 3.63V
- Pin 1 can be programmed as standby, output enable or not connected.
- Fraunhofer IISB
- Schottkystr. 10
- developed by:
- 91058 Erlangen
- Germany
- Author
- Project
- License
- Description
- File
- Version
- Release Date
- Sheet
- foxbms.org <https://foxbms.org>
- www.iisb.fraunhofer.de <https://www.iisb.fraunhofer.de/>
- foxBMS Team
- /

### Library data of the parts
C6100 = gen_C_ceramic_100n_50V_X7R_0402: as C3000 on sheet connectors-internal; Part Number: gen_C_ceramic_100n_50V_X7R_0402; Supplier 1: Farnell; Supplier Part Number 1: 2210822; ECCN: EAR99
R6100 = gen_R_10k_0402: as R1103 on sheet can-transceiver; Part Number: gen_R_10k_0402; Operating Temperature: -55°C - +155°C; Resistance: 10k; Series: E24, E96; PnP Value: 10k; Supplier 1: Farnell; Supplier Part Number 1: 2059239; ECCN: EAR99
Y6100 = SiT8924BAT31-33N-20.000000: Automotive AEC-Q100 Oscillator 20MHz; Manufacturer: SiTime; Automotive Qualified: True; AEC-Q Grade: Grade 0; Part Number: SiT8924BAT31-33N-20.000000; Part Name: SiT8924BAT31-33N-20.000000; Operating Temperature: -55°C - +125°C; ComponentLink1Description: Datasheet; ComponentLink1URL: https://www.sitime.com/datasheet/SiT8924; AEC-Q Norm: AEC-Q100; ECCN: EAR99

## Sheet oscillator-25MHz.SchDoc
size A3; DocumentNumber: 30; SheetNumber: 30; SheetTotal: 45; SheetDescription: Oscillator
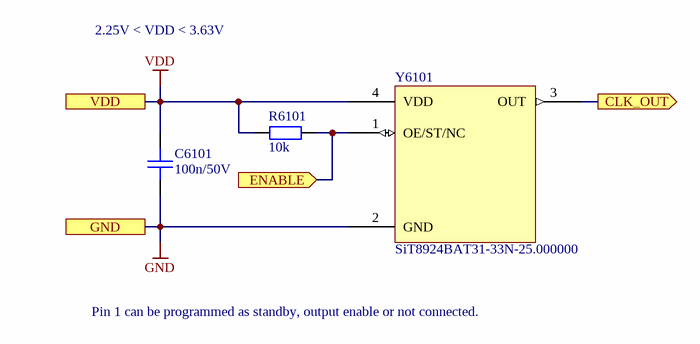
[diagram p20: oscillator-25MHz.SchDoc]

### Parts
C6101  100n/50V  [CAPC1005X06N]
R6101  10k  [RESC1005X04N]
Y6101  SiT8924BAT31-33N-25.000000  [SiT8924xx-3x]

### Ports
CLK_OUT (out), ENABLE (in), GND, VDD

### Nets
GND: C6101.1 Y6101.2(GND) ; port GND
VDD: C6101.2 R6101.1 Y6101.4(VDD) ; port VDD  [project net MCU_3.3V]
MCU_CLK.25MHz: Y6101.3(OUT) ; port CLK_OUT
NetR6101_2: R6101.2 Y6101.1(OE/ST/NC) ; port ENABLE

### Notes on the sheet
- 2.25V < VDD < 3.63V
- Pin 1 can be programmed as standby, output enable or not connected.
- Fraunhofer IISB
- Schottkystr. 10
- developed by:
- 91058 Erlangen
- Germany
- Author
- Project
- License
- Description
- File
- Version
- Release Date
- Sheet
- foxbms.org <https://foxbms.org>
- www.iisb.fraunhofer.de <https://www.iisb.fraunhofer.de/>
- foxBMS Team
- /

### Library data of the parts
C6101 = gen_C_ceramic_100n_50V_X7R_0402: as C3000 on sheet connectors-internal; Part Number: gen_C_ceramic_100n_50V_X7R_0402; Supplier 1: Farnell; Supplier Part Number 1: 2210822; ECCN: EAR99
R6101 = gen_R_10k_0402: as R1103 on sheet can-transceiver; Part Number: gen_R_10k_0402; Operating Temperature: -55°C - +155°C; Resistance: 10k; Series: E24, E96; PnP Value: 10k; Supplier 1: Farnell; Supplier Part Number 1: 2059239; ECCN: EAR99
Y6101 = SiT8924BAT31-33N-25.000000: Automotive AEC-Q100 Oscillator 25MHz; Manufacturer: SiTime; Automotive Qualified: True; AEC-Q Grade: Grade 0; Part Number: SiT8924BAT31-33N-25.000000; Part Name: SiT8924BAT31-33N-25.000000; Operating Temperature: -55°C - +125°C; ComponentLink1Description: Datasheet; ComponentLink1URL: https://www.sitime.com/datasheet/SiT8924; AEC-Q Norm: AEC-Q100; ECCN: EAR99

## Sheet window-watchdog.SchDoc
size A3; DocumentNumber: 40; SheetNumber: 40; SheetTotal: 45; SheetDescription: Window Watchdog
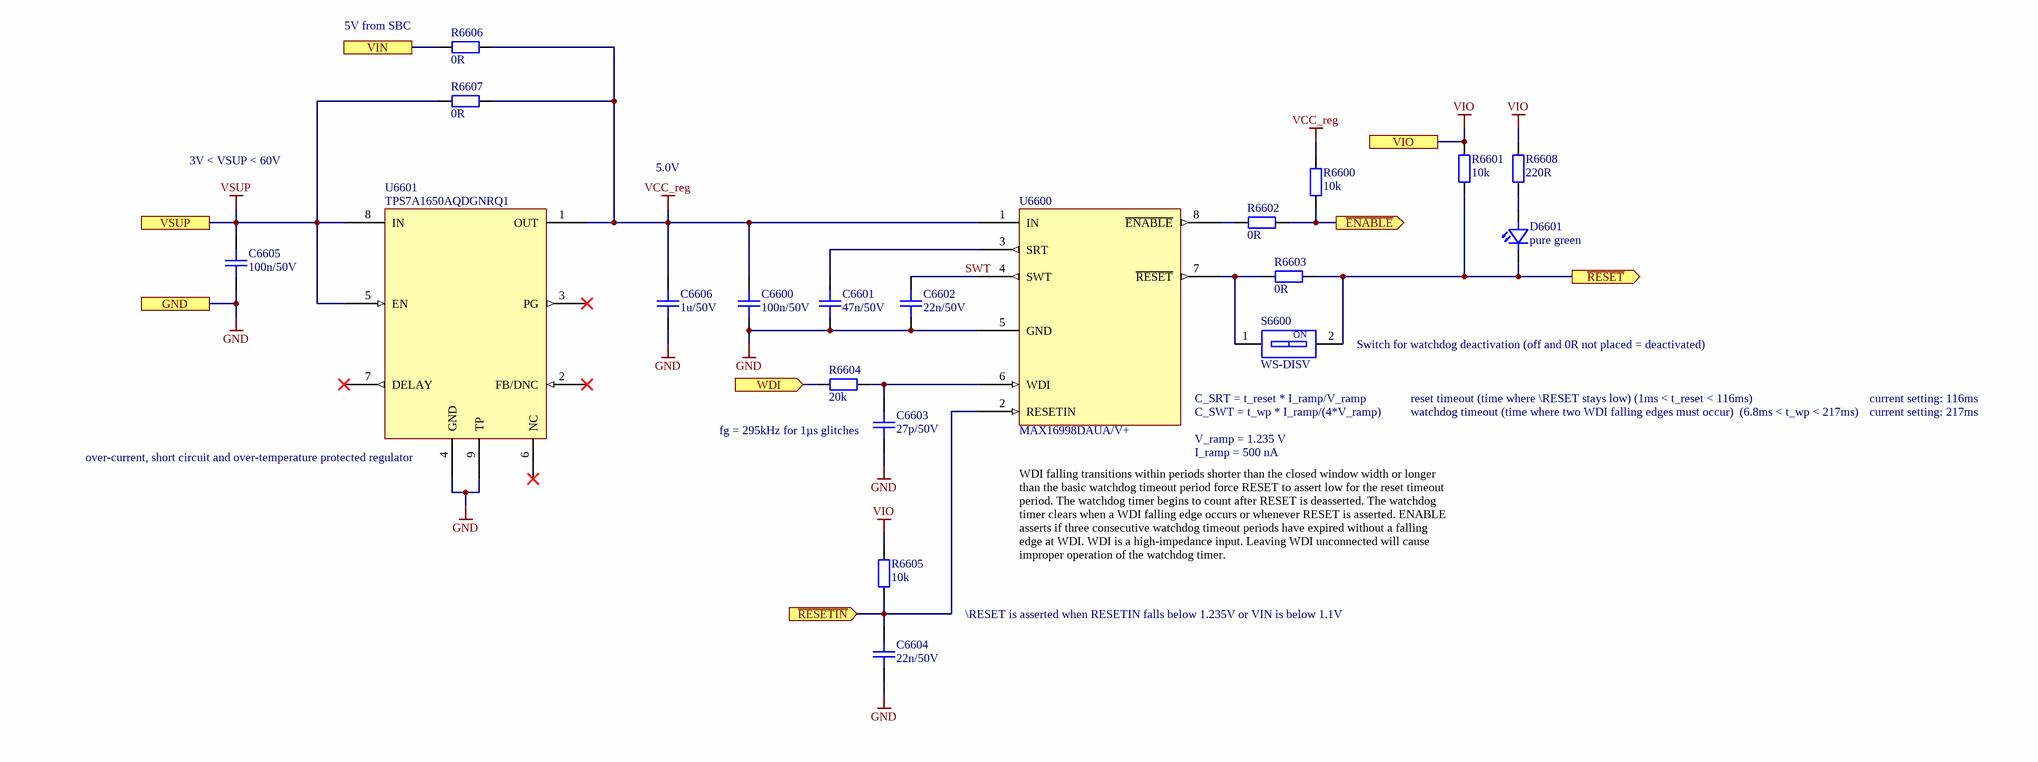
[diagram p21: window-watchdog.SchDoc]

### Parts
C6600  100n/50V  [CAPC1005X06N]
C6601  47n/50V  [CAPC1005X06N]
C6602  22n/50V  [CAPC1005X06N]
C6603  27p/50V  [CAPC1608X08N]
C6604  22n/50V  [CAPC1005X06N]
C6605  100n/50V  [CAPC1005X06N]
C6606  1u/50V  [CAPC1608X08N]
D6601  pure green  [LEDC1608X07N]
R6600  10k  [RESC1005X04N]
R6601  10k  [RESC1005X04N]
R6602  0R  [RESC1005X04N]
R6603  0R  [RESC1005X04N]
R6604  20k  [RESC1005X04N]
R6605  10k  [RESC1005X04N]
R6606  0R  [RESC1005X04N]
R6607  0R  [RESC1005X04N]
R6608  220R  [RESC1005X04N]
S6600  WS-DISV  [WE_416131160801]
U6600  MAX16998DAUA/V+  [MAX16998-uSOP8]
U6601  TPS7A1650AQDGNRQ1  [TPS7A16A-Q1]

### Ports
GND, VIN, VIO, VSUP, WDI (in), ~{ENABLE} (out), ~{RESETIN} (in), ~{RESET} (out)

### Nets
GND: C6600.1 C6601.1 C6602.1 C6603.1 C6604.1 C6605.1 C6606.1 U6600.5(GND) U6601.4(GND) U6601.9(TP) ; port GND
MCU_5.0V_LDO: R6606.1 ; port VIN
VCC_reg: C6600.2 C6606.2 R6600.2 R6606.2 R6607.2 U6600.1(IN) U6601.1(OUT)
VIO: R6601.2 R6605.2 R6608.2 ; port VIO  [project net MCU_3.3V]
VSUP: C6605.2 R6607.1 U6601.5(EN) U6601.8(IN) ; port VSUP  [project net VSUP_30]
~{DBG_RESET}: D6601.1(C) R6601.1 R6603.2 S6600.2 ; port ~{RESET}
EXT_CON~{.}SBC_MCU_RESET: C6604.2 R6605.1 U6600.2(RESETIN) ; port ~{RESETIN}
EXT_CON~{.}WW_ENABLE: R6600.1 R6602.2 ; port ~{ENABLE}
MCU_GIOX.K4: R6604.1 ; port WDI
SWT: C6602.2 U6600.4(SWT)  [project net SWT_40]
NetC6601_2: C6601.2 U6600.3(SRT)
NetC6603_2: C6603.2 R6604.2 U6600.6(WDI)
NetD6601_2: D6601.2(A) R6608.1
NetR6602_1: R6602.1 U6600.8(~{ENABLE})
NetR6603_1: R6603.1 S6600.1 U6600.7(~{RESET})

Not connected (* = marked no-connect by the designer): U6601 2(FB/DNC)* 3(PG)* 6(NC)* 7(DELAY)*

### Notes on the sheet
- (near R6606) 5V from SBC
- 3V < VSUP < 60V
- 5.0V
- (near S6600) Switch for watchdog deactivation (off and 0R not placed = deactivated)
- (near C6603) fg = 295kHz for 1µs glitches
- (near U6600) C_SRT = t_reset * I_ramp/V_ramp
- (near U6600) V_ramp = 1.235 V
- (near U6600) C_SWT = t_wp * I_ramp/(4*V_ramp)
- reset timeout (time where \RESET stays low) (1ms < t_reset < 116ms)
- watchdog timeout (time where two WDI falling edges must occur)  (6.8ms < t_wp < 217ms)
- current setting: 217ms
- current setting: 116ms
- (near U6601) over-current, short circuit and over-temperature protected regulator
- (near U6600) I_ramp = 500 nA
- WDI falling transitions within periods shorter than the closed window width or longer than the basic watchdog timeout period force RESET to assert low for the reset timeout period. The watchdog timer begins to count after RESET is deasserted. The watchdog timer clears when a WDI falling edge occurs or whenever RESET is asserted. ENABLE asserts if three consecutive watchdog timeout periods have expired without a falling edge at WDI. WDI is a high-impedance input. Leaving WDI unconnected will cause improper operation of the watchdog timer.
- \RESET is asserted when RESETIN falls below 1.235V or VIN is below 1.1V
- Fraunhofer IISB
- Schottkystr. 10
- developed by:
- 91058 Erlangen
- Germany
- Author
- Project
- License
- Description
- File
- Version
- Release Date
- Sheet
- foxbms.org <https://foxbms.org>
- www.iisb.fraunhofer.de <https://www.iisb.fraunhofer.de/>
- foxBMS Team
- /
- (in symbol WE_416131160801) ON

### Library data of the parts
C6600 C6605 = gen_C_ceramic_100n_50V_X7R_0402: MLCC; Capacitance: 100n; Rated Voltage: 50V; Dielectric: X7R; Case EIA: 0402; Case Metric: 1005; PnP Package: 0402C; PnP Value: 100nF/50V/X7R; PnP equipped: x; Automotive Qualified: True; AEC-Q Norm: AEC-Q200; Part Number: gen_C_ceramic_100n_50V_X7R_0402; Supplier 1: Farnell; Supplier Part Number 1: 2210822; ECCN: EAR99
C6601 = gen_C_ceramic_47n_50V_X7R_0402: MLCC; Capacitance: 47n; Rated Voltage: 50V; Dielectric: X7R; Case EIA: 0402; Case Metric: 1005; Automotive Qualified: True; PnP Package: 0402C; Part Number: gen_C_ceramic_47n_50V_X7R_0402; Supplier 1: Farnell; Supplier Part Number 1: 2210827
C6602 C6604 = gen_C_ceramic_22n_50V_X7R_0402: MLCC; Capacitance: 22n; Rated Voltage: 50V; Dielectric: X7R; Case EIA: 0402; Case Metric: 1005; Automotive Qualified: True; AEC-Q Grade: Grade 1; AEC-Q Norm: AEC-Q200; PnP Package: 0402C; Part Number: gen_C_ceramic_22n_50V_X7R_0402; ECCN: EAR99; Supplier 1: Digikey; Supplier Part Number 1: 490-4763-1-ND
C6603 = gen_C_ceramic_27p_50V_NP0_0603: MLCC; Capacitance: 27p; Rated Voltage: 50V; Dielectric: NP0; Case EIA: 0603; Case Metric: 1608; PnP Package: 0603C; Automotive Qualified: True; Part Number: gen_C_ceramic_27p_50V_NP0_0603; Supplier 1: Farnell; Supplier Part Number 1: 2219430
C6606 = gen_C_ceramic_1u_50V_X7R_0603: MLCC; Capacitance: 1u; Rated Voltage: 50V; Dielectric: X7R; Case EIA: 0603; Case Metric: 1608; Automotive Qualified: False; Tolerance: ± 10%; PnP Package: 0603C; Part Number: gen_C_ceramic_1u_50V_X7R_0603; Operating Temperature: -55°C - +125°C; Supplier 1: Farnell; Supplier Part Number 1: 2779055
D6601 = LED_0603_pure_green_AECQ: TLMP1100-GS08; Manufacturer: Vishay; Breakdown Voltage: 5V; Continuous Forward Current: 20mA; Forward Voltage @ 20mA: 2.1V; Automotive Qualified: True; Part Number: LED_0603_pure_green_AECQ; Color: pure green; Operating Temperature: -40°C - 100°C; ComponentLink1Description: Datasheet; ComponentLink1URL: http://www.farnell.com/datasheets/2049164.pdf; Supplier 1: Farnell; Supplier Part Number 1: 1328306; Supplier 2: Digikey; Supplier Part Number 2: 751-1176-1-ND; PnP Package: LED_0603
R6600 R6601 R6605 = gen_R_10k_0402: SMD Resistor 10k 0402; Tolerance: 1%; Power: 0.063W; Case EIA: 0402; Case Metric: 1005; Maximum Working Voltage: 50V; PnP Package: 0402R; PnP equipped: x; Automotive Qualified: True; AEC-Q Norm: AEC-Q200; Part Number: gen_R_10k_0402; Operating Temperature: -55°C - +155°C; Resistance: 10k; Series: E24, E96; PnP Value: 10k; Supplier 1: Farnell; Supplier Part Number 1: 2059239; ECCN: EAR99
R6602 R6603 R6606 R6607 = gen_R_0R_0402: SMD Resistor 0R 0402; Power: 0.063W; Case EIA: 0402; Case Metric: 1005; Maximum Working Voltage: 50V; PnP Package: 0402R; Automotive Qualified: True; AEC-Q Norm: AEC-Q200; PnP equipped: x; Part Number: gen_R_0R_0402; Operating Temperature: -55°C - +155°C; Resistance: 0R; Series: Jumper; PnP Value: 0R; Supplier 1: Farnell; Supplier Part Number 1: 1469661; Supplier 2: Farnell; Supplier Part Number 2: 2059190; ECCN: EAR99
R6604 = gen_R_20k_0402: SMD Resistor 20k 0402; Tolerance: 1%; Power: 0.063W; Case EIA: 0402; Case Metric: 1005; Maximum Working Voltage: 50V; PnP Package: 0402R; Automotive Qualified: True; PnP equipped: x; AEC-Q Norm: AEC-Q200; Part Number: gen_R_20k_0402; Operating Temperature: -55°C - +155°C; Resistance: 20k; Series: E24, E96; PnP Value: 20k; Supplier 1: Farnell; Supplier Part Number 1: 2059242; Supplier 2: Farnell; Supplier Part Number 2: 2059160; ECCN: EAR99
R6608 = gen_R_220R_0402: SMD Resistor 220R 0402; Tolerance: 1%; Power: 0.063W; Case EIA: 0402; Case Metric: 1005; Maximum Working Voltage: 50V; PnP Package: 0402R; Automotive Qualified: True; AEC-Q Norm: AEC-Q200; AEC-Q Grade: Grade 0; Part Number: gen_R_220R_0402; Operating Temperature: -55°C - +155°C; Resistance: 220R; Series: E24; PnP Value: 220R; Supplier 1: Digikey; Supplier Part Number 1: A129619CT-ND; ECCN: EAR99
S6600 = WE_416131160801: WS-DISV Small Compact SMT DipSwitch; Manufacturer: Würth Elektronik; Automotive Qualified: False; Part Number: WE_416131160801; Part Name: WS-DISV; Operating Temperature: -40°C - +85°C; ComponentLink1Description: Datasheet; ComponentLink1URL: https://www.we-online.de/katalog/datasheet/418121270801.pdf; Supplier 1: Digikey; Supplier Part Number 1: 732-3851-1-ND; Supplier 2: Mouser; Supplier Part Number 2: 710-416131160801
U6600 = MAX16998DAUA/V+: High-Voltage Watchdog Timers with Adjustable Timeout Delay; Manufacturer: Maxim Integrated; PnP Package: uSOP-8; Automotive Qualified: True; Part Number: MAX16998DAUA/V+; Part Name: MAX16998DAUA/V+; Operating Temperature: −40°C - +125°C; ComponentLink1Description: Datasheet; ComponentLink1URL: https://www.mouser.de/datasheet/2/256/MAX16997-MAX16998-1292640.pdf; Supplier 1: Mouser; Supplier Part Number 1: 700-MAX16998DAUA/V+
U6601 = TPS7A1650AQDGNRQ1: Automotive 60-V, 5-µA IQ, 100-mA low-dropout (LDO) voltage regulator with enable and power good; Manufacturer: Texas Instruments; PnP Package: HVSSOP-8; Automotive Qualified: True; AEC-Q Norm: AEC-Q100; AEC-Q Grade: Grade 1; Part Number: TPS7A1650AQDGNRQ1; Part Name: TPS7A16A-Q1; Operating Temperature: -40°C - +125°C; ComponentLink1Description: Datasheet; ComponentLink1URL: http://www.ti.com/lit/ds/symlink/tps7a16a-q1.pdf; Supplier 1: Mouser; Supplier Part Number 1: 595-PS7A1650AQDGNRQ1; Supplier 2: Digikey; Supplier Part Number 2: 296-TPS7A1650AQDGNRQ1TR-ND; ECCN: EAR99

## Sheet memory.SchDoc
size A3; DocumentNumber: 31; SheetNumber: 31; SheetTotal: 45; SheetDescription: FRAM, MRAM and Flash Memory
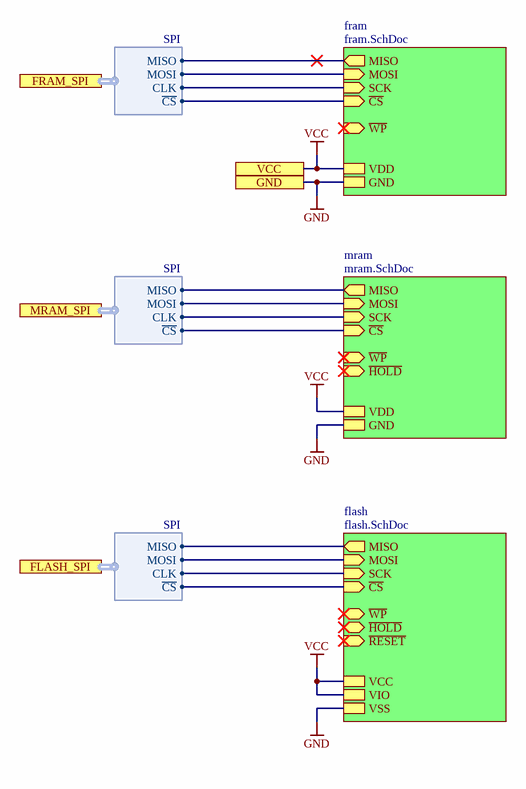
[diagram p22: memory.SchDoc]

### Sub-sheets
flash = flash.SchDoc: MISO (out), ~{CS} (in), MOSI (in), SCK (in), ~{RESET} (in), ~{HOLD} (bidir), VCC, ~{WP} (bidir), VSS, VIO
fram = fram.SchDoc: MISO (out), ~{CS} (in), MOSI (in), SCK (in), GND, ~{WP} (in), VDD
mram = mram.SchDoc: MISO (out), ~{CS} (in), MOSI (in), SCK (in), GND, ~{WP} (in), VDD, ~{HOLD} (in)

### Ports
FLASH_SPI (harness SPI), FRAM_SPI (harness SPI), GND, MRAM_SPI (harness SPI), VCC

### Harnesses
SPI: CLK, MOSI, MISO, ~{CS}

### Nets
GND: port GND, sheet fram/GND, sheet mram/GND, sheet flash/VSS
VCC: port VCC, sheet fram/VDD, sheet mram/VDD, sheet flash/VCC, sheet flash/VIO  [project net MCU_3.3V]
FLASH_SPI~{.}CS: sheet flash/~{CS}, port FLASH_SPI.~{CS}
FLASH_SPI.CLK: sheet fram/SCK, sheet mram/SCK, sheet flash/SCK, port FRAM_SPI.CLK, port MRAM_SPI.CLK, port FLASH_SPI.CLK
FLASH_SPI.MISO: sheet fram/MISO, sheet mram/MISO, sheet flash/MISO, port FRAM_SPI.MISO, port MRAM_SPI.MISO, port FLASH_SPI.MISO
FLASH_SPI.MOSI: sheet fram/MOSI, sheet mram/MOSI, sheet flash/MOSI, port FRAM_SPI.MOSI, port MRAM_SPI.MOSI, port FLASH_SPI.MOSI
FRAM_SPI~{.}CS: sheet fram/~{CS}, port FRAM_SPI.~{CS}
MCU_SPI3~{.}sCS6: sheet mram/~{CS}, port MRAM_SPI.~{CS}

### Notes on the sheet
- Fraunhofer IISB
- Schottkystr. 10
- developed by:
- 91058 Erlangen
- Germany
- Author
- Project
- License
- Description
- File
- Version
- Release Date
- Sheet
- foxbms.org <https://foxbms.org>
- www.iisb.fraunhofer.de <https://www.iisb.fraunhofer.de/>
- foxBMS Team
- /

## Sheet fram.SchDoc
size A3; DocumentNumber: 33; SheetNumber: 33; SheetTotal: 45; SheetDescription: Ferroelectric Random Access Memory (FRAM)
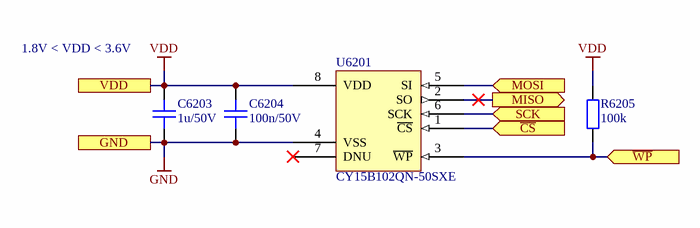
[diagram p23: fram.SchDoc]

### Parts
C6203  1u/50V  [CAPC1608X08N]
C6204  100n/50V  [CAPC1005X06N]
R6205  100k  [RESC1005X04N]
U6201  CY15B102QN-50SXE  [CY15B102QN-50SXE]

### Ports
GND, MISO (out), MOSI (in), SCK (in), VDD, ~{CS} (in), ~{WP} (in)

### Nets
GND: C6203.1 C6204.1 U6201.4(VSS) ; port GND
VDD: C6203.2 C6204.2 R6205.2 U6201.8(VDD) ; port VDD  [project net MCU_3.3V]
FLASH_SPI.CLK: U6201.6(SCK) ; port SCK
FLASH_SPI.MISO: U6201.2(SO) ; port MISO
FLASH_SPI.MOSI: U6201.5(SI) ; port MOSI
FRAM_SPI~{.}CS: U6201.1(~{CS}) ; port ~{CS}
NetR6205_1: R6205.1 U6201.3(~{WP}) ; port ~{WP}

Not connected (* = marked no-connect by the designer): U6201 7(DNU)*

### Notes on the sheet
- (near C6203) 1.8V < VDD < 3.6V
- Fraunhofer IISB
- Schottkystr. 10
- developed by:
- 91058 Erlangen
- Germany
- Author
- Project
- License
- Description
- File
- Version
- Release Date
- Sheet
- foxbms.org <https://foxbms.org>
- www.iisb.fraunhofer.de <https://www.iisb.fraunhofer.de/>
- foxBMS Team
- /

### Library data of the parts
C6203 = gen_C_ceramic_1u_50V_X7R_0603: as C6606 on sheet window-watchdog; Part Number: gen_C_ceramic_1u_50V_X7R_0603; Operating Temperature: -55°C - +125°C; Supplier 1: Farnell; Supplier Part Number 1: 2779055
C6204 = gen_C_ceramic_100n_50V_X7R_0402: as C6600 on sheet window-watchdog; Part Number: gen_C_ceramic_100n_50V_X7R_0402; Supplier 1: Farnell; Supplier Part Number 1: 2210822; ECCN: EAR99
R6205 = gen_R_100k_0402: SMD Resistor 100k 0402; Tolerance: 1%; Power: 0.063W; Case EIA: 0402; Case Metric: 1005; Maximum Working Voltage: 50V; PnP Package: 0402R; PnP equipped: x; Automotive Qualified: True; Part Number: gen_R_100k_0402; Operating Temperature: -55°C - +155°C; Resistance: 100k; Series: E24, E96; PnP Value: 100k; Supplier 1: Farnell; Supplier Part Number 1: 2302839
U6201 = CY15B102QN-50SXE: Excelon™-Auto 2-Mbit (256K × 8) Automotive-E Serial (SPI) F-RAM; Manufacturer: Cypress; PnP Package: SOIC-8; Automotive Qualified: True; Part Number: CY15B102QN-50SXE; Part Name: CY15B102QN-50SXE; Operating Temperature: −40°C - +125°C; ComponentLink1Description: Datasheet; ComponentLink1URL: https://www.cypress.com/file/400736/download; Supplier 1: Mouser; Supplier Part Number 1: 727-CY15B102QN-50SXE

## Sheet mram.SchDoc
size A3; DocumentNumber: 34; SheetNumber: 34; SheetTotal: 45; SheetDescription: Magnetoresistive RAM (MRAM)
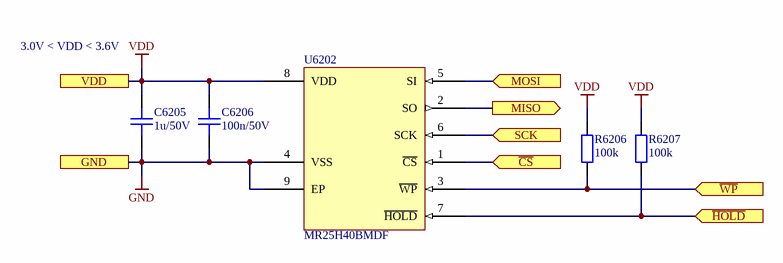
[diagram p24: mram.SchDoc]

### Parts
C6205  1u/50V  [CAPC1608X08N]
C6206  100n/50V  [CAPC1005X06N]
R6206  100k  [RESC1005X04N]
R6207  100k  [RESC1005X04N]
U6202  MR25H40BMDF  [MR25H40]

### Ports
GND, MISO (out), MOSI (in), SCK (in), VDD, ~{CS} (in), ~{HOLD} (in), ~{WP} (in)

### Nets
GND: C6205.1 C6206.1 U6202.4(VSS) U6202.9(EP) ; port GND
VDD: C6205.2 C6206.2 R6206.2 R6207.2 U6202.8(VDD) ; port VDD  [project net MCU_3.3V]
FLASH_SPI.CLK: U6202.6(SCK) ; port SCK
FLASH_SPI.MISO: U6202.2(SO) ; port MISO
FLASH_SPI.MOSI: U6202.5(SI) ; port MOSI
MCU_SPI3~{.}sCS6: U6202.1(~{CS}) ; port ~{CS}
NetR6206_1: R6206.1 U6202.3(~{WP}) ; port ~{WP}
NetR6207_1: R6207.1 U6202.7(~{HOLD}) ; port ~{HOLD}

### Notes on the sheet
- 3.0V < VDD < 3.6V
- Fraunhofer IISB
- Schottkystr. 10
- developed by:
- 91058 Erlangen
- Germany
- Author
- Project
- License
- Description
- File
- Version
- Release Date
- Sheet
- foxbms.org <https://foxbms.org>
- www.iisb.fraunhofer.de <https://www.iisb.fraunhofer.de/>
- foxBMS Team
- /

### Library data of the parts
C6205 = gen_C_ceramic_1u_50V_X7R_0603: as C6606 on sheet window-watchdog; Part Number: gen_C_ceramic_1u_50V_X7R_0603; Operating Temperature: -55°C - +125°C; Supplier 1: Farnell; Supplier Part Number 1: 2779055
C6206 = gen_C_ceramic_100n_50V_X7R_0402: as C6600 on sheet window-watchdog; Part Number: gen_C_ceramic_100n_50V_X7R_0402; Supplier 1: Farnell; Supplier Part Number 1: 2210822; ECCN: EAR99
R6206 R6207 = gen_R_100k_0402: as R6205 on sheet fram; Part Number: gen_R_100k_0402; Operating Temperature: -55°C - +155°C; Resistance: 100k; Series: E24, E96; PnP Value: 100k; Supplier 1: Farnell; Supplier Part Number 1: 2302839
U6202 = MR25H40BMDF: Magnetoresistive random access memory (MRAM) device; Manufacturer: Everspin; PnP Package: DFN-8; Automotive Qualified: False; Part Number: MR25H40BMDF; Part Name: MR25H40BMDF; Operating Temperature: −40°C - +125°C

## Sheet flash.SchDoc
size A3; DocumentNumber: 32; SheetNumber: 32; SheetTotal: 45; SheetDescription: NOR Flash memory
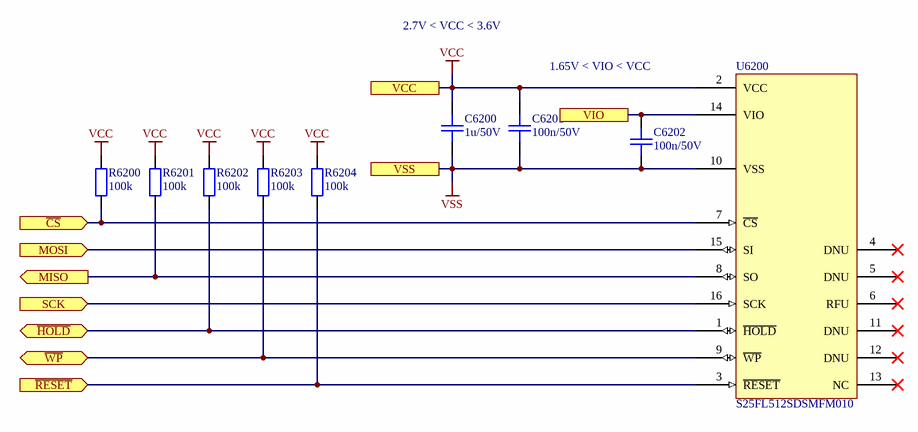
[diagram p25: flash.SchDoc]

### Parts
C6200  1u/50V  [CAPC1608X08N]
C6201  100n/50V  [CAPC1005X06N]
C6202  100n/50V  [CAPC1005X06N]
R6200  100k  [RESC1005X04N]
R6201  100k  [RESC1005X04N]
R6202  100k  [RESC1005X04N]
R6203  100k  [RESC1005X04N]
R6204  100k  [RESC1005X04N]
U6200  S25FL512SDSMFM010  [S25FL512S-SO3016]

### Ports
MISO (out), MOSI (in), SCK (in), VCC, VIO, VSS, ~{CS} (in), ~{HOLD} (bidir), ~{RESET} (in), ~{WP} (bidir)

### Nets
VCC: C6200.2 C6201.2 C6202.2 R6200.2 R6201.2 R6202.2 R6203.2 R6204.2 U6200.2(VCC) U6200.14(VIO) ; port VCC, port VIO  [project net MCU_3.3V]
VSS: C6200.1 C6201.1 C6202.1 U6200.10(VSS) ; port VSS  [project net GND]
FLASH_SPI~{.}CS: R6200.1 U6200.7(~{CS}) ; port ~{CS}
FLASH_SPI.CLK: U6200.16(SCK) ; port SCK
FLASH_SPI.MISO: R6201.1 U6200.8(SO) ; port MISO
FLASH_SPI.MOSI: U6200.15(SI) ; port MOSI
NetR6202_1: R6202.1 U6200.1(~{HOLD}) ; port ~{HOLD}
NetR6203_1: R6203.1 U6200.9(~{WP}) ; port ~{WP}
NetR6204_1: R6204.1 U6200.3(~{RESET}) ; port ~{RESET}

Not connected (* = marked no-connect by the designer): U6200 4(DNU)* 5(DNU)* 6(RFU)* 11(DNU)* 12(DNU)* 13(NC)*

### Notes on the sheet
- 2.7V < VCC < 3.6V
- 1.65V < VIO < VCC
- Fraunhofer IISB
- Schottkystr. 10
- developed by:
- 91058 Erlangen
- Germany
- Author
- Project
- License
- Description
- File
- Version
- Release Date
- Sheet
- foxbms.org <https://foxbms.org>
- www.iisb.fraunhofer.de <https://www.iisb.fraunhofer.de/>
- foxBMS Team
- /

### Library data of the parts
C6200 = gen_C_ceramic_1u_50V_X7R_0603: as C6606 on sheet window-watchdog; Part Number: gen_C_ceramic_1u_50V_X7R_0603; Operating Temperature: -55°C - +125°C; Supplier 1: Farnell; Supplier Part Number 1: 2779055
C6201 C6202 = gen_C_ceramic_100n_50V_X7R_0402: as C6600 on sheet window-watchdog; Part Number: gen_C_ceramic_100n_50V_X7R_0402; Supplier 1: Farnell; Supplier Part Number 1: 2210822; ECCN: EAR99
R6200-R6204 = gen_R_100k_0402: as R6205 on sheet fram; Part Number: gen_R_100k_0402; Operating Temperature: -55°C - +155°C; Resistance: 100k; Series: E24, E96; PnP Value: 100k; Supplier 1: Farnell; Supplier Part Number 1: 2302839
U6200 = S25FL512SDSMFM010: 512 Mbit (64 Mbyte), 3.0 V SPI Flash Memory; Manufacturer: Cypress; PnP Package: SOIC-16; Automotive Qualified: True; Part Number: S25FL512SDSMFM010; Part Name: S25FL512SDSMFM010; Operating Temperature: −40°C - +125°C; ComponentLink1Description: Datasheet; ComponentLink1URL: https://www.cypress.com/file/177971/download; Supplier 1: Mouser; Supplier Part Number 1: 727-S25FL512SSMFM010; Supplier 2: Digikey; Supplier Part Number 2: S25FL512SDSMFM010-ND

## Sheet sensor-hum-temp.SchDoc
size A3; DocumentNumber: 38; SheetNumber: 38; SheetTotal: 45; SheetDescription: Humidity and Temperature Sensor
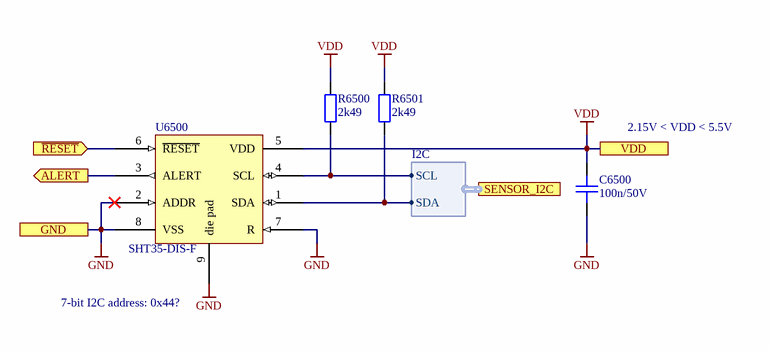
[diagram p26: sensor-hum-temp.SchDoc]

### Parts
C6500  100n/50V  [CAPC1005X06N]
R6500  2k49  [RESC1005X04N]
R6501  2k49  [RESC1005X04N]
U6500  SHT35-DIS-F  [SHT3X]

### Ports
ALERT (out), GND, SENSOR_I2C (harness I2C), VDD, ~{RESET} (in)

### Harnesses
I2C: SDA, SCL

### Nets
GND: C6500.1 U6500.2(ADDR) U6500.7(R) U6500.8(VSS) U6500.9(die_pad) ; port GND
VDD: C6500.2 R6500.2 R6501.2 U6500.5(VDD) ; port VDD  [project net PER_3.3V]
MCU_I2C1.SCL: R6500.1 U6500.4(SCL) ; port SENSOR_I2C.SCL
MCU_I2C1.SDA: R6501.1 U6500.1(SDA) ; port SENSOR_I2C.SDA
PE_IO3.IO0_0: U6500.6(~{RESET}) ; port ~{RESET}
PE_IO3.IO0_1: U6500.3(ALERT) ; port ALERT

### Notes on the sheet
- 2.15V < VDD < 5.5V
- 7-bit I2C address: 0x44?
- Fraunhofer IISB
- Schottkystr. 10
- developed by:
- 91058 Erlangen
- Germany
- Author
- Project
- License
- Description
- File
- Version
- Release Date
- Sheet
- foxbms.org <https://foxbms.org>
- www.iisb.fraunhofer.de <https://www.iisb.fraunhofer.de/>
- foxBMS Team
- /

### Library data of the parts
C6500 = gen_C_ceramic_100n_50V_X7R_0402: as C6600 on sheet window-watchdog; Part Number: gen_C_ceramic_100n_50V_X7R_0402; Supplier 1: Farnell; Supplier Part Number 1: 2210822; ECCN: EAR99
R6500 R6501 = gen_R_2k49_0402: SMD Resistor 2k49 0402; Tolerance: 1%; Power: 0.063W; Case EIA: 0402; Case Metric: 1005; Maximum Working Voltage: 50V; PnP Package: 0402R; Automotive Qualified: True; Part Number: gen_R_2k49_0402; Operating Temperature: -55°C - +155°C; Resistance: 2k49; Series: E96; PnP Value: 2k49; Supplier 1: Farnell; Supplier Part Number 1: 2059135
U6500 = SHT35-DIS-F: Humidity/Temp Sensor, Digital, Dfn-8; Manufacturer: Sensirion; PnP Package: DFN; Automotive Qualified: True; Part Number: SHT35-DIS-F; Part Name: SHT35-DIS-F; Operating Temperature: -40°C - +125°C; ComponentLink1Description: Datasheet; ComponentLink1URL: http://www.farnell.com/datasheets/2756487.pdf; Supplier 1: Farnell; Supplier Part Number 1: 2886656; Supplier 2: Digikey; Supplier Part Number 2: 1649-1067-1-ND; Supplier 3: Mouser; Supplier Part Number 3: 403-SHT35-DIS-F